# EAGLE design Dash Controller (EAGLE 9.1.1)
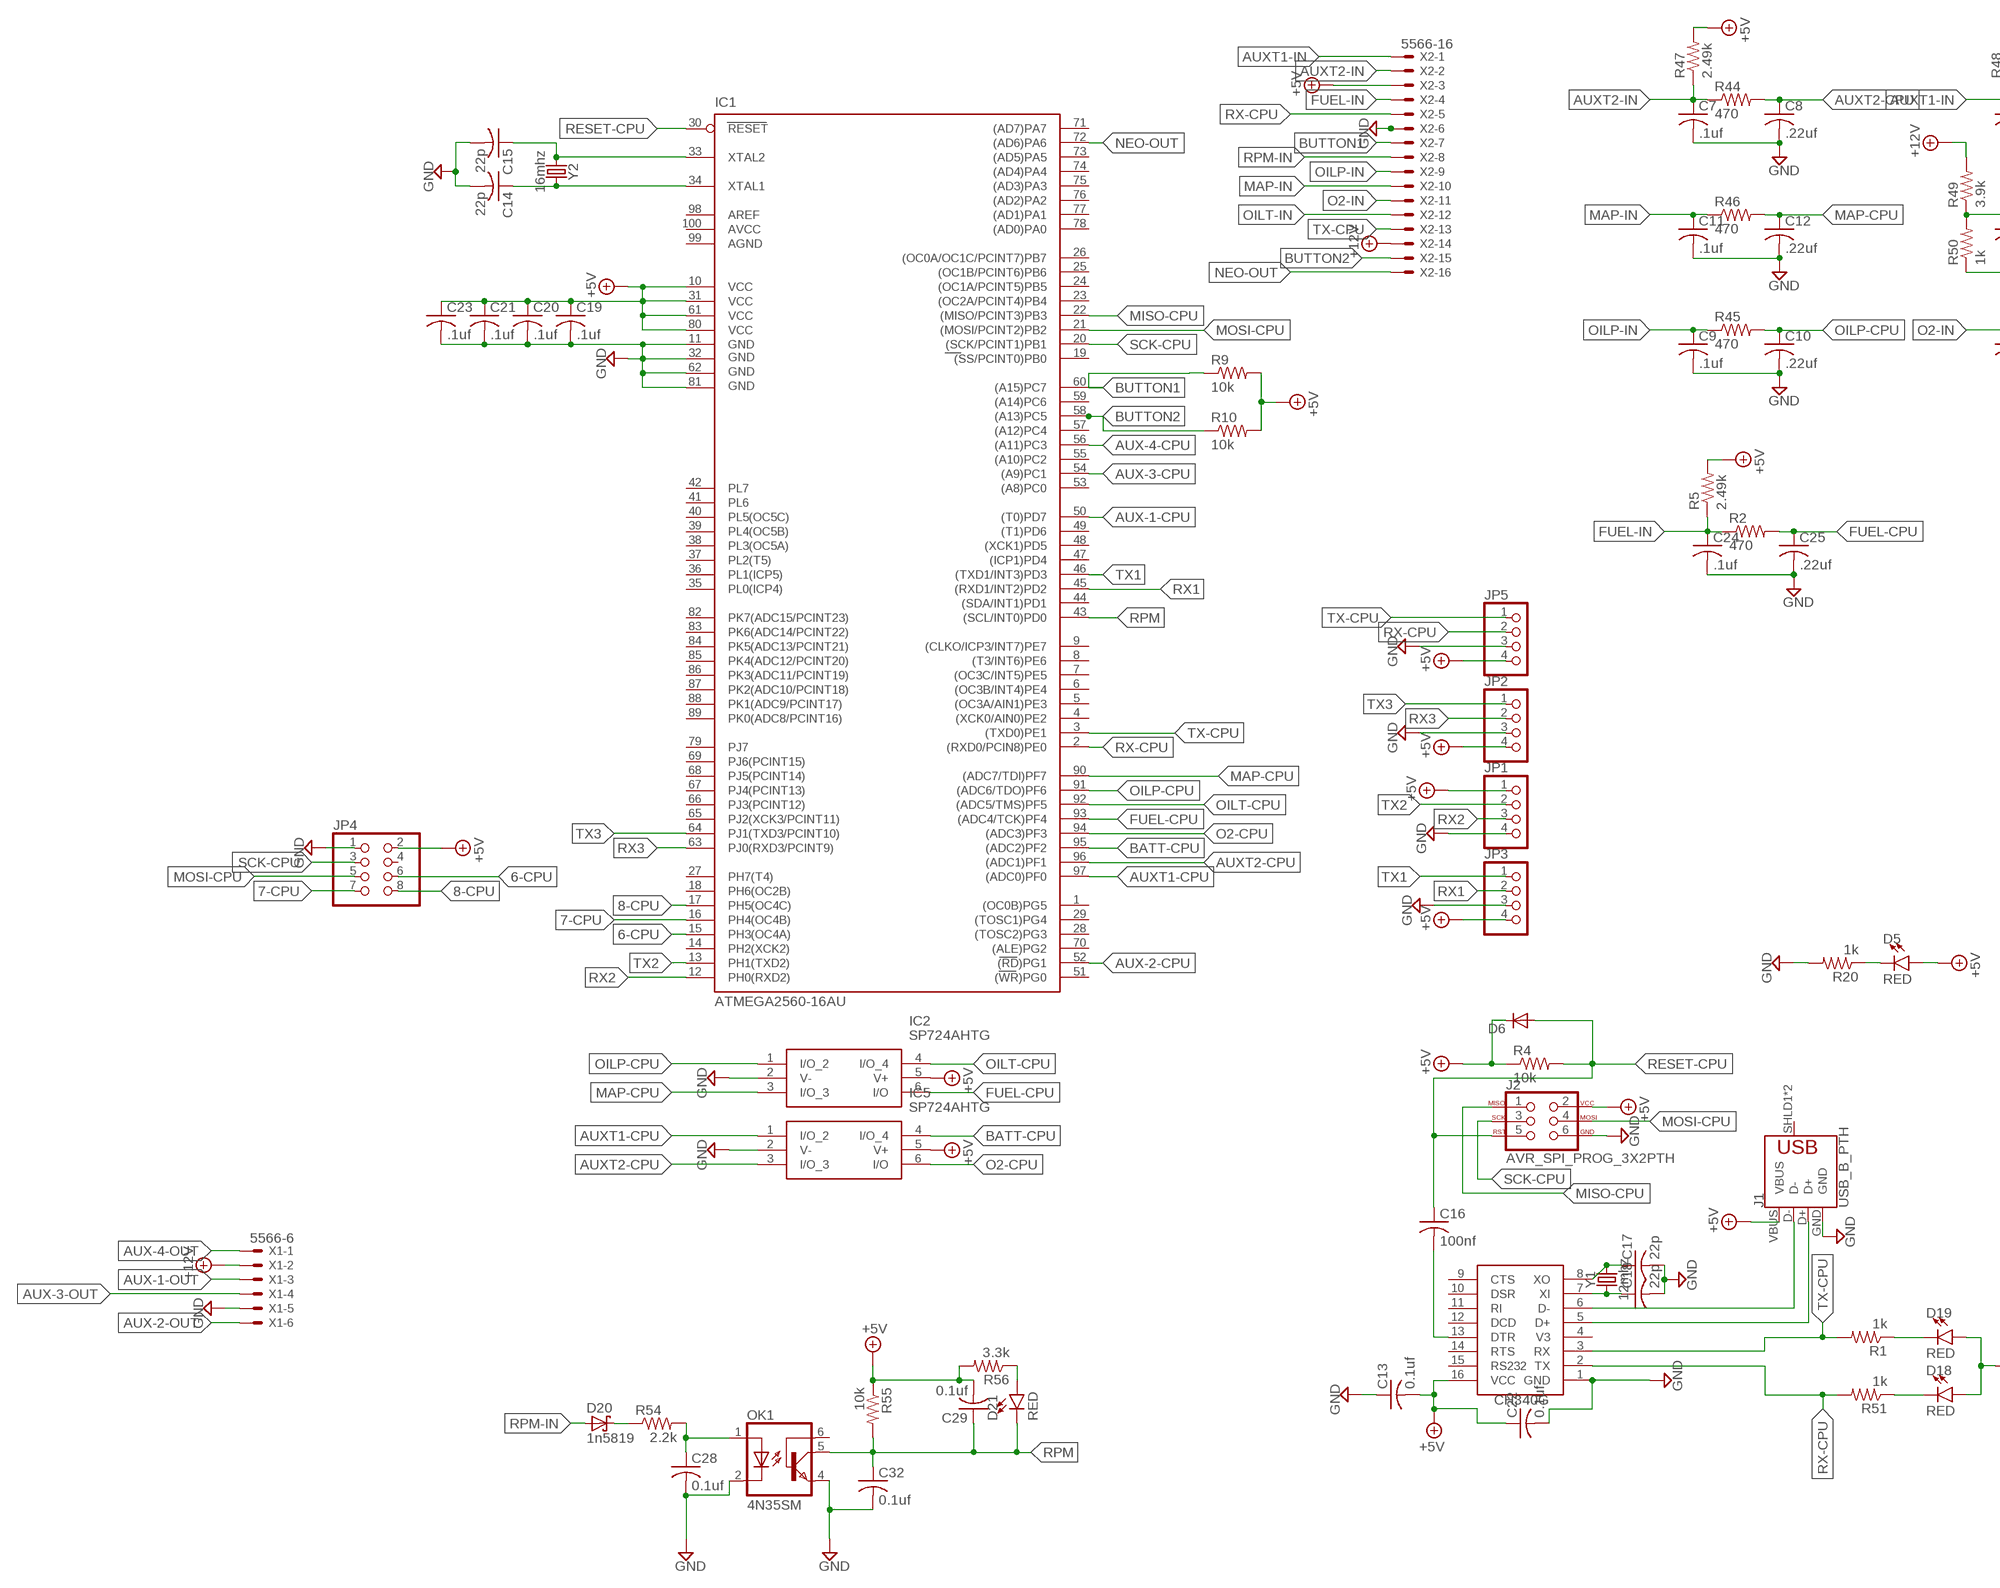
[diagram p0: schematic, sheet 1, part 1 of 2]
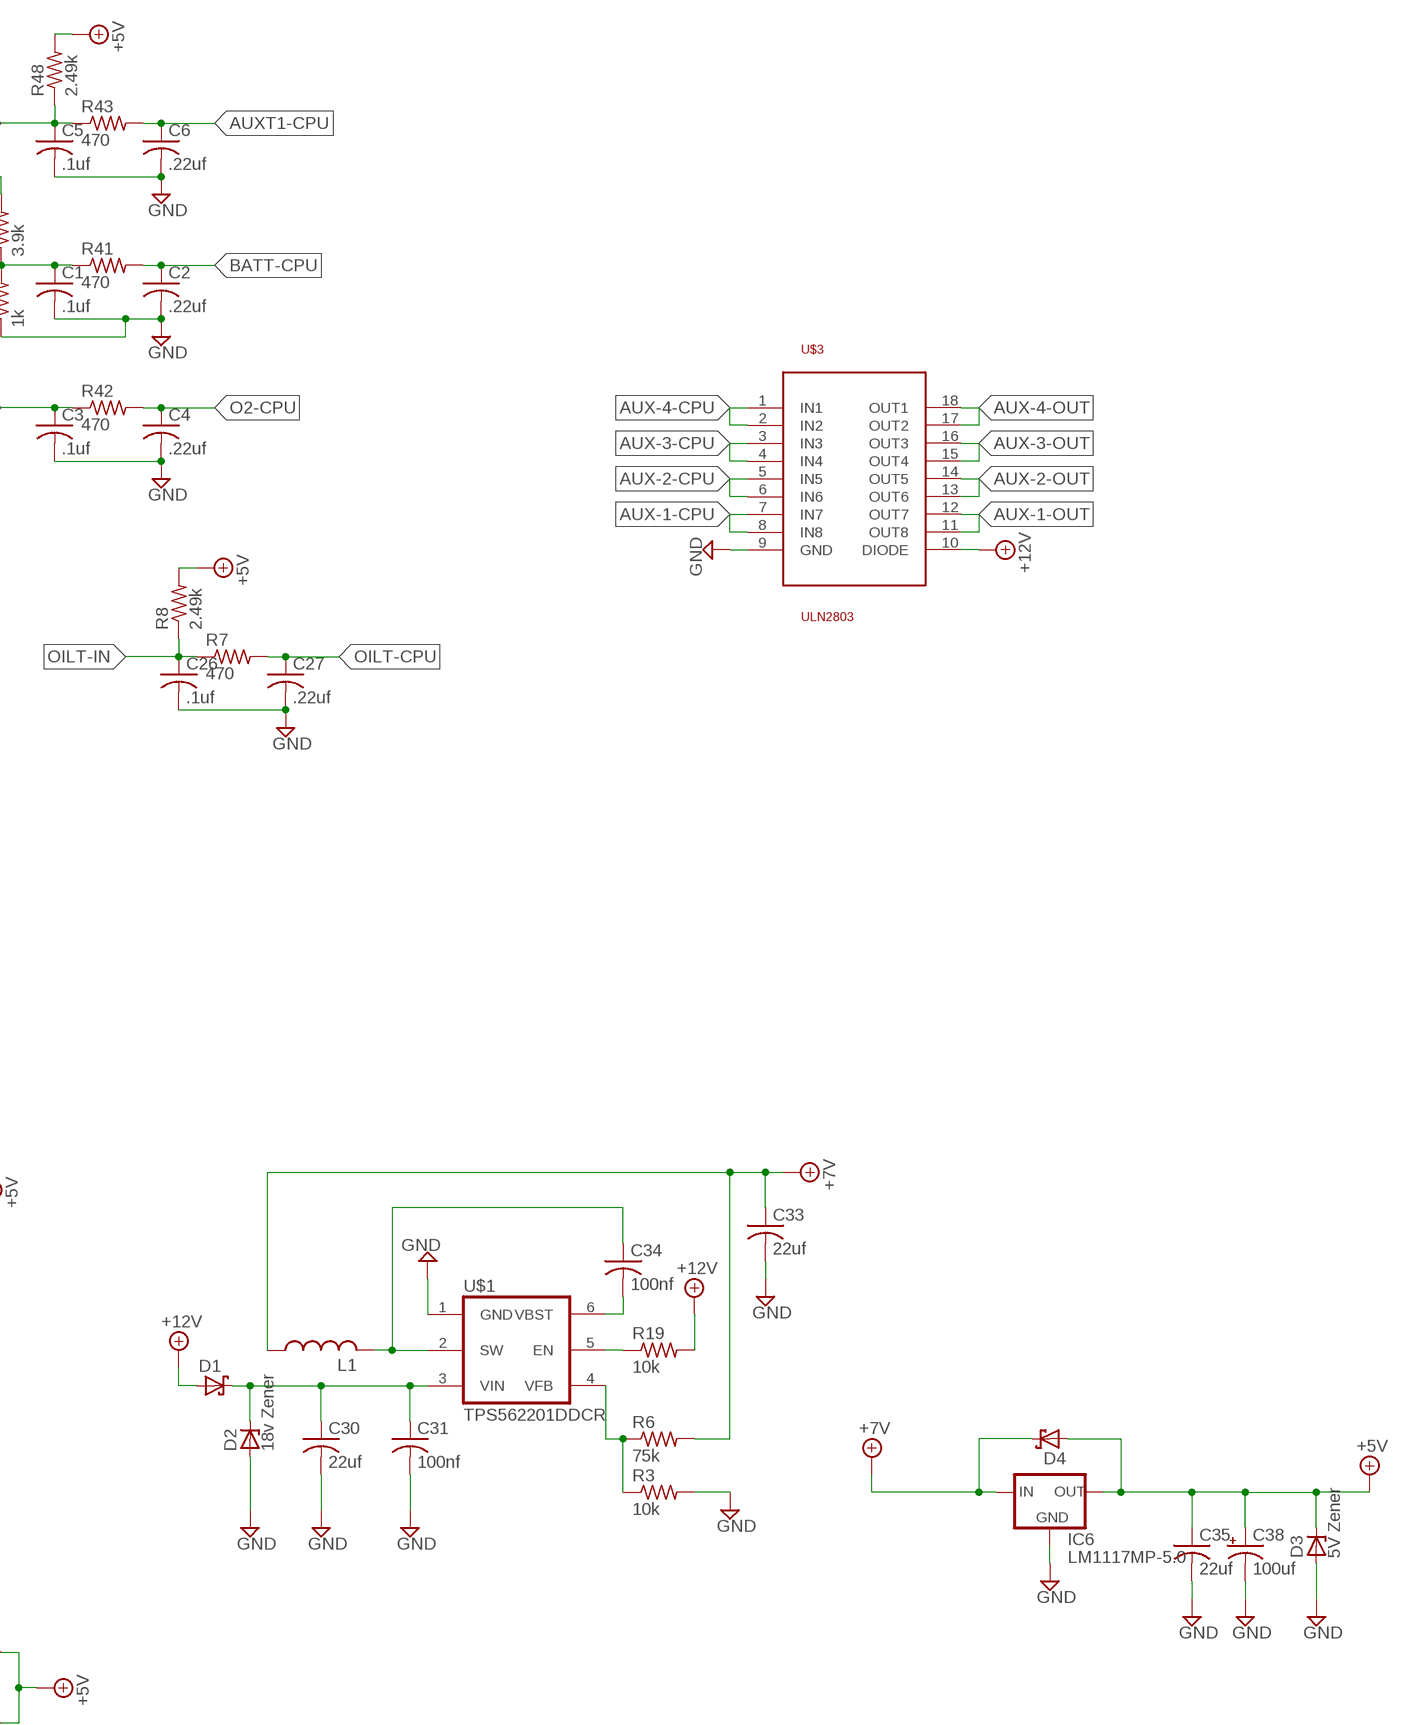
[diagram p1: schematic, sheet 1, part 2 of 2]

## Parts
C1  .1uf  C-USC1206  [C1206]
C2  .22uf  C-USC1206  [C1206]
C3  .1uf  C-USC1206  [C1206]
C4  .22uf  C-USC1206  [C1206]
C5  .1uf  C-USC1206  [C1206]
C6  .22uf  C-USC1206  [C1206]
C7  .1uf  C-USC1206  [C1206]
C8  .22uf  C-USC1206  [C1206]
C9  .1uf  C-USC1206  [C1206]
C10  .22uf  C-USC1206  [C1206]
C11  .1uf  C-USC1206  [C1206]
C12  .22uf  C-USC1206  [C1206]
C13  0.1uf  C-USC1206  [C1206]
C14  22p  C-USC1206  [C1206]
C15  22p  C-USC1206  [C1206]
C16  100nf  C-USC1206  [C1206]
C17  22p  C-USC1206  [C1206]
C18  22p  C-USC1206  [C1206]
C19  .1uf  C-USC1206  [C1206]
C20  .1uf  C-USC1206  [C1206]
C21  .1uf  C-USC1206  [C1206]
C22  0.1uf  C-USC1206  [C1206]
C23  .1uf  C-USC1206  [C1206]
C24  .1uf  C-USC1206  [C1206]
C25  .22uf  C-USC1206  [C1206]
C26  .1uf  C-USC1206  [C1206]
C27  .22uf  C-USC1206  [C1206]
C28  0.1uf  C-USC1206  [C1206]
C29  0.1uf  C-USC1206  [C1206]
C30  22uf  C-USC1206  [C1206]
C31  100nf  C-USC1206  [C1206]
C32  0.1uf  C-USC1206  [C1206]
C33  22uf  C-USC1206  [C1206]
C34  100nf  C-USC1206  [C1206]
C35  22uf  C-USC1206  [C1206]
C38  100uf  CPOL-US153CLV-0605  [153CLV-0605]
D1  SCHOTTKY-DIODESMD  [SMB]
D2  18v Zener  ZENER-DIODESMB  [SMB]
D3  5V Zener  ZENER-DIODESMB  [SMB]
D4  SCHOTTKY-DIODESMD  [SMB]
D5  RED  LED-RED1206  [LED-1206]
D6  DIODE-DO214AA  [DO214AA]
D18  RED  LED-RED1206  [LED-1206]
D19  RED  LED-RED1206  [LED-1206]
D20  1n5819  SCHOTTKY-DIODESMD  [SMB]
D21  RED  LED-RED1206  [LED-1206]
IC1  ATMEGA2560-16AU  [TQFP100]
IC2  SP724AHTG  [SOT95P280X145-6N]
IC5  SP724AHTG  [SOT95P280X145-6N]
IC6  LM1117MP-5.0  [SOT223]
J1  USB_B_PTH  [USB-B-PTH]
J2  AVR_SPI_PROG_3X2PTH  [2X3]
JP1  PINHD-1X4  [1X04]
JP2  PINHD-1X4  [1X04]
JP3  PINHD-1X4  [1X04]
JP4  PINHD-2X4  [2X04]
JP5  PINHD-1X4  [1X04]
L1  L-USPIS2816  [PIS2816]
OK1  4N35SM  [DIL6-SMD]
R1  1k  R-US_R1206  [R1206]
R2  470  R-US_R1206  [R1206]
R3  10k  R-US_R1206  [R1206]
R4  10k  R-US_R1206  [R1206]
R5  2.49k  R-US_R1206  [R1206]
R6  75k  R-US_R1206  [R1206]
R7  470  R-US_R1206  [R1206]
R8  2.49k  R-US_R1206  [R1206]
R9  10k  R-US_R1206  [R1206]
R10  10k  R-US_R1206  [R1206]
R19  10k  R-US_R1206  [R1206]
R20  1k  R-US_R1206  [R1206]
R41  470  R-US_R1206  [R1206]
R42  470  R-US_R1206  [R1206]
R43  470  R-US_R1206  [R1206]
R44  470  R-US_R1206  [R1206]
R45  470  R-US_R1206  [R1206]
R46  470  R-US_R1206  [R1206]
R47  2.49k  R-US_R1206  [R1206]
R48  2.49k  R-US_R1206  [R1206]
R49  3.9k  R-US_R1206  [R1206]
R50  1k  R-US_R1206  [R1206]
R51  1k  R-US_R1206  [R1206]
R54  2.2k  R-US_R1206  [R1206]
R55  10k  R-US_R1206  [R1206]
R56  3.3k  R-US_R1206  [R1206]
U$1  TPS562201DDCR  [SOT23-6L]
U$2  CH340G  [SOIC16]
U$3  ULN2803  [SO18L]
X1  5566-6  [5566-6]
X2  5566-16  [5566-16]
Y1  12mhz  CRYSTALPTH-HC49UV  [HC49U]
Y2  16mhz  CRYSTALPTH-HC49UV  [HC49U]

## Nets
6-CPU: IC1.15(PH3(OC4A)) JP4.6
7-CPU: IC1.16(PH4(OC4B)) JP4.7
8-CPU: IC1.17(PH5(OC4C)) JP4.8
+5V [5V+]: C13.2 C19.1 C20.1 C21.1 C22.1 C23.1 C29.2 C35.1 C38.+ D3.C D4.A D5.A D6.C D18.A D19.A IC1.10(VCC) IC1.31(VCC1) IC1.61(VCC2) IC1.80(VCC3) IC2.5(V+) IC5.5(V+) IC6.2(OUT) IC6.4(OUT) J1.VBUS J2.2 JP1.1 JP2.4 JP3.4 JP4.2 JP5.4 R4.1 R5.2 R8.2 R9.2 R10.2 R47.2 R48.2 R55.1 R56.2 U$2.16(VCC) X2.3
+7V: C33.1 D4.C IC6.3(IN) L1.1 R6.2
+12V [Power]: D1.A R19.2 R49.2 U$3.10(DIODE) X1.2 X2.14
AUX-1-CPU: IC1.50((T0)PD7) U$3.7(IN7) U$3.8(IN8)
AUX-1-OUT [Output]: U$3.11(OUT8) U$3.12(OUT7) X1.3
AUX-2-CPU: IC1.52((RD)PG1) U$3.5(IN5) U$3.6(IN6)
AUX-2-OUT [Output]: U$3.13(OUT6) U$3.14(OUT5) X1.6
AUX-3-CPU: IC1.54((A9)PC1) U$3.3(IN3) U$3.4(IN4)
AUX-3-OUT [Output]: U$3.15(OUT4) U$3.16(OUT3) X1.4
AUX-4-CPU: IC1.56((A11)PC3) U$3.1(IN1) U$3.2(IN2)
AUX-4-OUT [Output]: U$3.17(OUT2) U$3.18(OUT1) X1.1
AUXT1-CPU: C6.1 IC1.97((ADC0)PF0) IC5.1(I/O_2) R43.2
AUXT1-IN: C5.1 R43.1 R48.1 X2.1
AUXT2-CPU: C8.1 IC1.96((ADC1)PF1) IC5.3(I/O_3) R44.2
AUXT2-IN: C7.1 R44.1 R47.1 X2.2
BATT-CPU: C2.1 IC1.95((ADC2)PF2) IC5.4(I/O_4) R41.2
BUTTON1: IC1.60((A15)PC7) R9.1 X2.7
BUTTON2: IC1.58((A13)PC5) R10.1 X2.15
FUEL-CPU: C25.1 IC1.93((ADC4/TCK)PF4) IC2.6(I/O) R2.2
FUEL-IN: C24.1 R2.1 R5.1 X2.4
GND [GND]: C1.2 C2.2 C3.2 C4.2 C5.2 C6.2 C7.2 C8.2 C9.2 C10.2 C11.2 C12.2 C13.1 C14.2 C15.2 C17.2 C18.2 C19.2 C20.2 C21.2 C22.2 C23.2 C24.2 C25.2 C26.2 C27.2 C28.2 C30.2 C31.2 C32.2 C33.2 C35.2 C38.- D2.A D3.A IC1.11(GND) IC1.32(GND1) IC1.62(GND2) IC1.81(GND3) IC2.2(V-) IC5.2(V-) IC6.1(GND) J1.GND J2.6 JP1.4 JP2.3 JP3.3 JP4.1 JP5.3 OK1.2(C) OK1.4(EMI) R3.2 R20.2 R50.1 U$1.1(GND) U$2.1(GND) U$3.9(GND) X1.5 X2.6
MAP-CPU: C12.1 IC1.90((ADC7/TDI)PF7) IC2.3(I/O_3) R46.2
MAP-IN: C11.1 R46.1 X2.10
MISO-CPU: IC1.22((MISO/PCINT3)PB3) J2.1
MOSI-CPU: IC1.21((MOSI/PCINT2)PB2) J2.4 JP4.5
N$2: J1.D+ U$2.5(D+)
N$3: J1.D- U$2.6(D-)
N$5: C14.1 IC1.34(XTAL1) Y2.2
N$6: C15.1 IC1.33(XTAL2) Y2.1
N$8: D5.C R20.1
N$9: C16.2 U$2.13(DTR)
N$15: C18.1 U$2.7(XI) Y1.1
N$16: C17.1 U$2.8(XO) Y1.2
N$22: C30.1 C31.1 D1.C D2.C U$1.3(VIN)
N$23: C34.2 U$1.6(VBST)
N$24: R19.1 U$1.5(EN)
N$42: C1.1 R41.1 R49.1 R50.2
N$100: D19.C R1.1
N$101: D18.C R51.1
N$107: D20.C R54.1
N$108: C28.1 OK1.1(A) R54.2
N$110: D21.A R56.1
NEO-OUT [IGN]: IC1.72((AD6)PA6) X2.16
O2-CPU: C4.1 IC1.94((ADC3)PF3) IC5.6(I/O) R42.2
O2-IN: C3.1 R42.1 X2.11
OILP-CPU: C10.1 IC1.91((ADC6/TDO)PF6) IC2.1(I/O_2) R45.2
OILP-IN: C9.1 R45.1 X2.9
OILT-CPU: C27.1 IC1.92((ADC5/TMS)PF5) IC2.4(I/O_4) R7.2
OILT-IN: C26.1 R7.1 R8.1 X2.12
RESET-CPU: C16.1 D6.A IC1.30(RESET) J2.5 R4.2
RPM: C29.1 C32.1 D21.C IC1.43((SCL/INT0)PD0) OK1.5(COL) R55.2
RPM-IN: D20.A X2.8
RX1: IC1.45((RXD1/INT2)PD2) JP3.2
RX2: IC1.12(PH0(RXD2)) JP1.3
RX3: IC1.63(PJ0(RXD3/PCINT9)) JP2.2
RX-CPU: IC1.2((RXD0/PCIN8)PE0) JP5.2 R51.2 U$2.2(TX) X2.5
SCK-CPU: IC1.20((SCK/PCINT1)PB1) J2.3 JP4.3
SW: C34.1 L1.2 U$1.2(SW)
TX1: IC1.46((TXD1/INT3)PD3) JP3.1
TX2: IC1.13(PH1(TXD2)) JP1.2
TX3: IC1.64(PJ1(TXD3/PCINT10)) JP2.1
TX-CPU: IC1.3((TXD0)PE1) JP5.1 R1.2 U$2.3(RX) X2.13
VFB: R3.1 R6.1 U$1.4(VFB)
Unconnected: IC1.1((OC0B)PG5) IC1.4((XCK0/AIN0)PE2) IC1.5((OC3A/AIN1)PE3) IC1.6((OC3B/INT4)PE4) IC1.7((OC3C/INT5)PE5) IC1.8((T3/INT6)PE6) IC1.9((CLKO/ICP3/INT7)PE7) IC1.14(PH2(XCK2)) IC1.18(PH6(OC2B)) IC1.19((SS/PCINT0)PB0) IC1.23((OC2A/PCINT4)PB4) IC1.24((OC1A/PCINT5)PB5) IC1.25((OC1B/PCINT6)PB6) IC1.26((OC0A/OC1C/PCINT7)PB7) IC1.27(PH7(T4)) IC1.28((TOSC2)PG3) IC1.29((TOSC1)PG4) IC1.35(PL0(ICP4)) IC1.36(PL1(ICP5)) IC1.37(PL2(T5)) IC1.38(PL3(OC5A)) IC1.39(PL4(OC5B)) IC1.40(PL5(OC5C)) IC1.41(PL6) IC1.42(PL7) IC1.44((SDA/INT1)PD1) IC1.47((ICP1)PD4) IC1.48((XCK1)PD5) IC1.49((T1)PD6) IC1.51((WR)PG0) IC1.53((A8)PC0) IC1.55((A10)PC2) IC1.57((A12)PC4) IC1.59((A14)PC6) IC1.65(PJ2(XCK3/PCINT11)) IC1.66(PJ3(PCINT12)) IC1.67(PJ4(PCINT13)) IC1.68(PJ5(PCINT14)) IC1.69(PJ6(PCINT15)) IC1.70((ALE)PG2) IC1.71((AD7)PA7) IC1.73((AD5)PA5) IC1.74((AD4)PA4) IC1.75((AD3)PA3) IC1.76((AD2)PA2) IC1.77((AD1)PA1) IC1.78((AD0)PA0) IC1.79(PJ7) IC1.82(PK7(ADC15/PCINT23)) IC1.83(PK6(ADC14/PCINT22)) IC1.84(PK5(ADC13/PCINT21)) IC1.85(PK4(ADC12/PCINT20)) IC1.86(PK3(ADC11/PCINT19)) IC1.87(PK2(ADC10/PCINT18)) IC1.88(PK1(ADC9/PCINT17)) IC1.89(PK0(ADC8/PCINT16)) IC1.98(AREF) J1.SHLD1(SHIELD) J1.SHLD2(SHIELD) JP4.4 OK1.6(BAS) U$2.4(V3) U$2.9(CTS) U$2.10(DSR) U$2.11(RI) U$2.12(DCD) U$2.14(RTS) U$2.15(RS232)

## Power pins joined to a net without a drawn wire
AGND: IC1.99(AGND)
AVCC: IC1.100(AVCC)

## Library data of the parts
C1-C32 C34 = resistor:C-US: CAPACITOR, American symbol
C33 C35 = resistor:C-US: CAPACITOR, American symbol; SPICEPREFIX: C
C38 = resistor:CPOL-US: POLARIZED CAPACITOR, American symbol
D1 D4 D20 = diode:SCHOTTKY-DIODE: Schottky Diode
D2 D3 = diode:ZENER-DIODE: Z-Diode
D5 D18 D19 D21 = SparkFun-LED:LED-RED: Red SMD LED Used in manufacturing of most products at SparkFun Packages: 0603 - SMD 0603 package [Product Link] <http://docs.avagotech.com/docs/AV02-0551EN> 0603 SMART - SMD 0603 SMART package ( more efficient and expensive)[Product Link] <http://www.osram-os.com/Graphics/XPic2/00077099_0.pdf> 1206 - SMD1206 package [Product Link] <https://www.sparkfun.com/datasheets/DevTools/LilyPad/Q150OVS4.pdff> SparkFun Products: Pro Mini 328 -5V <https://www.sparkfun.com/products/821> RedBoard <https://www.sparkfun.com/products/12757> IOIO-OTG <https://www.sparkfun.com/products/13613>; PROD_ID: DIO-09912
D6 = diode:DIODE-: DIODE
IC1 = atmel-2005:ATMEGA*: MICROCONTROLLER 64/128/256 Kbytes FLASH 4 Kbytes EEPROM 8 Kbytes SRAM 86 General Purpose I/O pins 12-channels16-bit PWM 4 x Serial USARTs 16-channels 10-bit A/D
IC2 IC5 = SP724AHTG:SP724AHTG: Littelfuse SP724AHTG Quad Uni-Directional Over-voltage Protector, 6-Pin SOT-23 Source: Datasheet; ARROW_PART_NUMBER: SP724AHTG; ARROW_PRICE/STOCK: https://www.arrow.com/en/products/sp724ahtg/littelfuse; DESCRIPTION: Littelfuse SP724AHTG Quad Uni-Directional Over-voltage Protector, 6-Pin SOT-23; HEIGHT: mm; MANUFACTURER_NAME: LITTELFUSE; MANUFACTURER_PART_NUMBER: SP724AHTG; RS_PART_NUMBER: 7931982; RS_PRICE/STOCK: http://uk.rs-online.com/web/p/products/7931982
IC6 = lm1117_10:LM1117?-*: 800mA Low-Dropout Linear Regulator Source: http://www.ti.com/lit/ds/symlink/lm1117-n.pdf; MF: Texas Instruments; MPN: LM1117MP-5.0; OC_FARNELL: 9778209; OC_NEWARK: 28X3417
J1 = SparkFun-Connectors:USB_B: USB Type B Connector SparkFun Products: SparkFun Stepoko <https://www.sparkfun.com/products/13899> PTH; PROD_ID: CONN-08278; SF_ID: PRT-00139
J2 = SparkFun-Connectors:AVR_SPI_PROG_3X2: AVR ISP 6 Pin This is the reduced ISP connector for AVR programming. Common on Arduino. This footprint will take up less PCB space and can be used with a 10-pin to 6-pin adapter such as SKU: BOB-08508 **Special note about "TEST_POINT" package. The stop mask is on the top side, so if you want your programming test points to be on the bottom of your board, make sure to place this package on the bottom side of the board. This also ensure that the orientation to program from the bottom side will be correct. SparkFun Products: SparkFun ISP Pogo Adapter <https://www.sparkfun.com/products/11591> - NS Tiny AVR Programmer <https://www.sparkfun.com/products/11801> -PTH
JP1-JP3 JP5 = pinhead:PINHD-1X4: PIN HEADER
JP4 = pinhead:PINHD-2X4: PIN HEADER
L1 = rcl:L-US: INDUCTOR, American symbol
OK1 = optocoupler:4N*?M: General Purpose 6-Pin Phototransistor Optocouplers Source: http://www.fairchildsemi.com/ds/4N/4N35-M.pdf; MF: FAIRCHILD SEMICONDUCTOR; MPN: 4N35S-M; OC_FARNELL: 1021179; OC_NEWARK: 67K2285
R1-R10 R19 R20 R41-R51 R54-R56 = resistor:R-US_: RESISTOR, American symbol
U$1 = TPS562201DDCR:TPS562201DDCR
U$2 = ch340g:CH340G
U$3 = ULN2803:ULN2803; AVAILABILITY: Unavailable; MF: Toshiba; MP: ULN2803; PACKAGE: SOIC-18 Toshiba; PRICE: None
X1 = Molex_connectors:5566-6: Mini FIT connector 6 pol Source: http://www.molex.com; MF: MOLEX; MPN: 95566-61002; OC_FARNELL: unknown; OC_NEWARK: 22K8620
X2 = Molex_connectors:5566-16: Mini FIT connector 16 pol Source: http://www.molex.com; MF: MOLEX; OC_FARNELL: unknown; OC_NEWARK: unknown
Y1 Y2 = SparkFun-Clocks:CRYSTAL: Crystals (Generic) These are passive quartz crystals, which can be used as a clock source for a microcontroller. Crystal's are two-terminal devices. They require external "load" capacitors to generate an oscillating signal.

## Net classes
0 default: width 0.254 mm, clearance 0.152 mm
1 Power: width 0.762 mm, clearance 0.152 mm
2 Output: width 0.61 mm, clearance 0.152 mm
3 IGN: width 0.305 mm, clearance 0.152 mm
4 5V+: width 0.305 mm, clearance 0.152 mm
5 Relay: width 0.406 mm, clearance 0.152 mm
6 GND: width 0.305 mm, clearance 0.152 mm

## Board
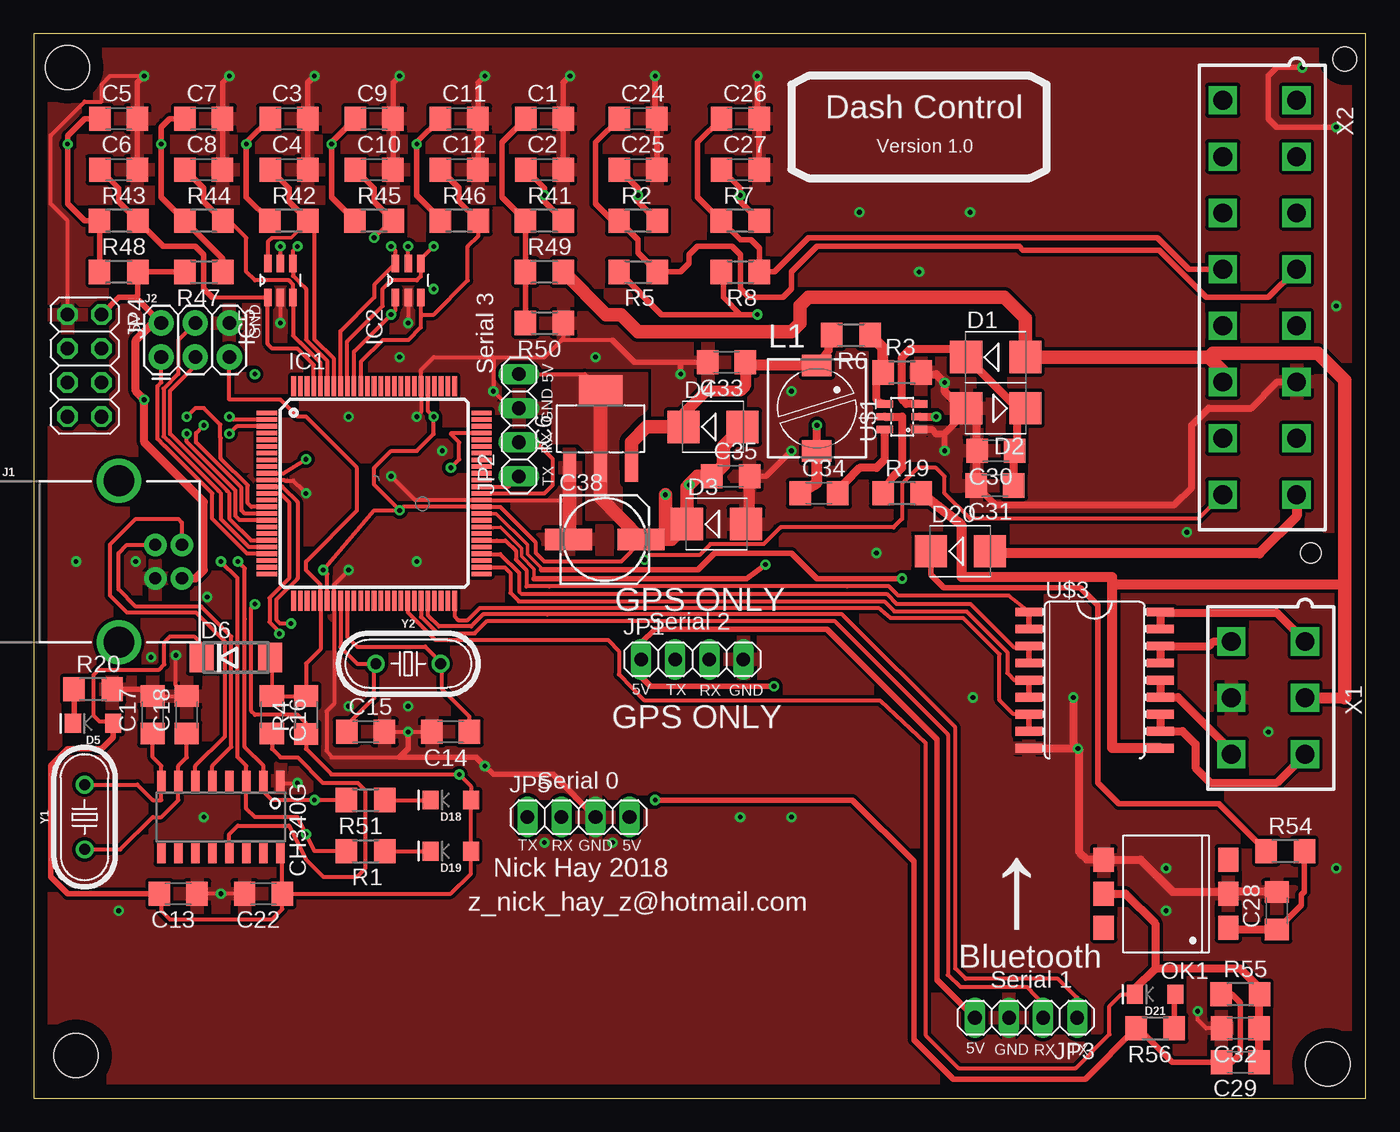
[diagram p2: board, top side]
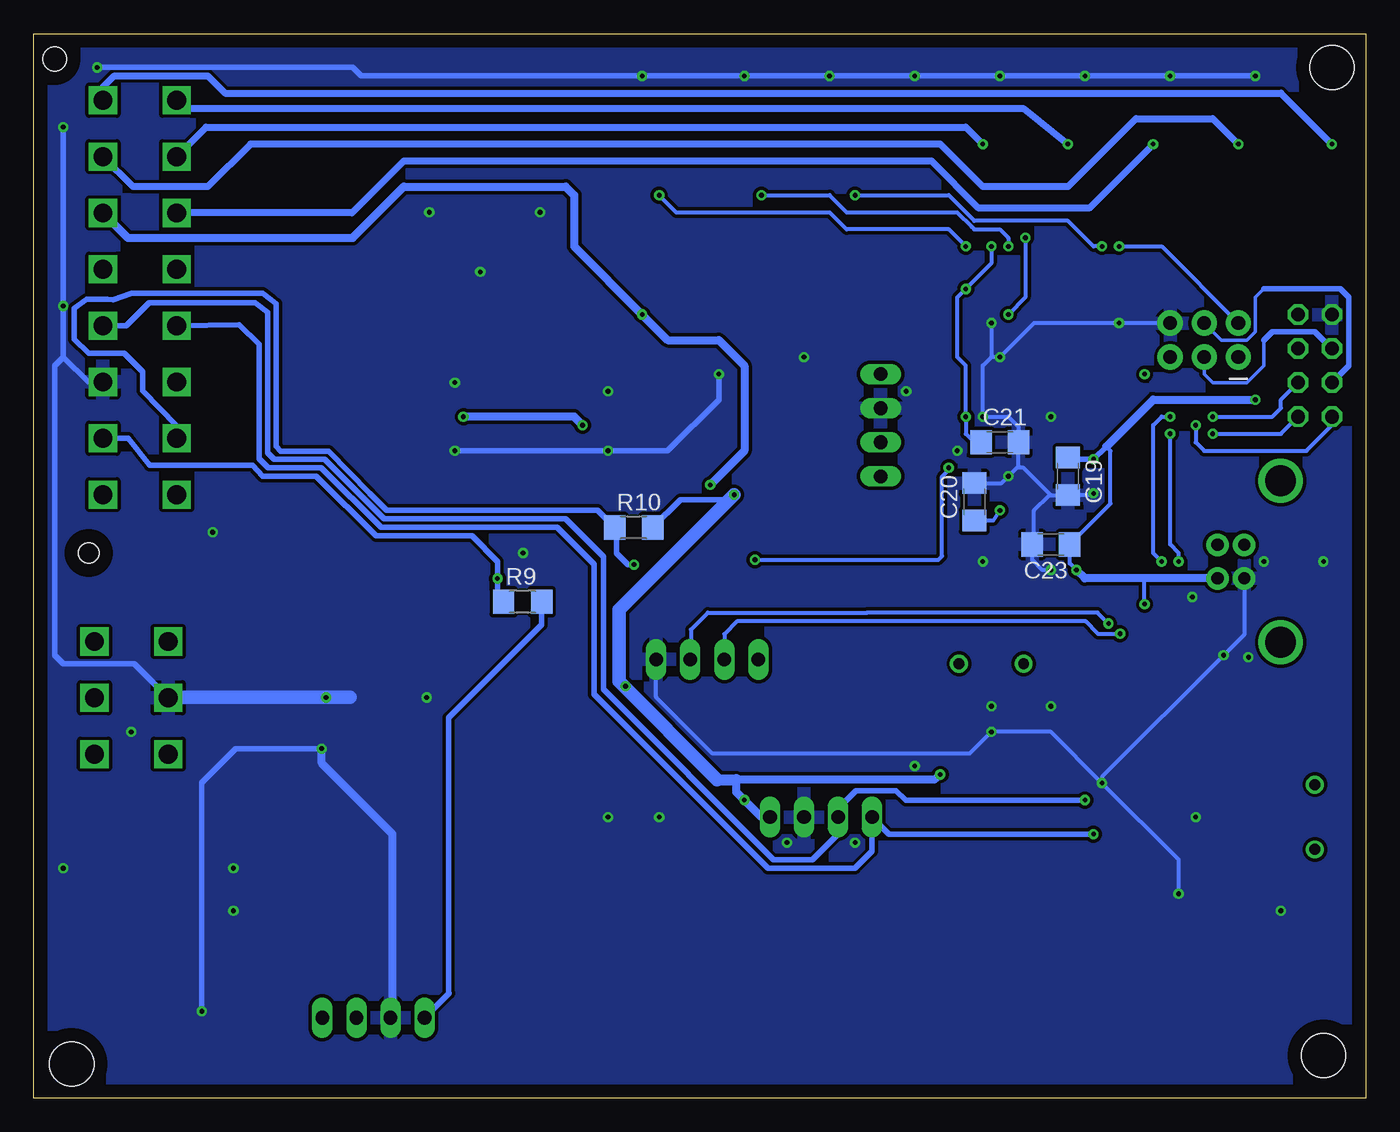
[diagram p3: board, bottom side, seen from below]

Size 99.36 x 79.36 mm. Coordinates in mm from the lower left corner, seen from the top.
Outline: 0,0 99.36,0 99.36,79.36 0,79.36 0,0
Copper layers (1*16): Top 0.035mm / dielectric 1.5mm / Bottom 0.035mm
Design rules "default": minimum track width 6mil, minimum drill 0.35mm, track to track 6mil, track to pad 6mil, pad to pad 6mil, via to via 6mil, smd to smd 6mil, copper to edge 40mil, drill to drill 6mil, minimum pad ring 10mil, minimum via ring 8mil, stop-mask expansion 4mil, vias tented up to drill 0mil, thermal gap 10mil
Holes 3.3 mm at 2.54,76.83 96.52,2.54 3.17,3.17
Holes 1.78 mm at 97.79,77.47
Holes 1.52 mm at 95.25,40.64

### Footprints (pad centres in the part's own frame; a part is rotated, then mirrored left to right if it is on the bottom)
C1206 = smd 1.6 x 1.8: 1 -1.4,0; 2 1.4,0
153CLV-0605 = smd 3.5 x 1.6: + 2.7,0; - -2.7,0
SMB = smd 2.4 x 2.4: A 2.2,0; C -2.2,0
LED-1206 = smd 1.2 x 1.4: A -1.5,0; C 1.5,0
DO214AA = smd 1.8 x 2.2: A 2.55,0; C -2.55,0
TQFP100 = smd 1.5 x 0.35: 1 -8,6; 2 -8,5.5; 3 -8,5; 4 -8,4.5; 5 -8,4; 6 -8,3.5; 7 -8,3; 8 -8,2.5; 9 -8,2; 10 -8,1.5; 11 -8,1; 12 -8,0.5; 13 -8,0; 14 -8,-0.5; 15 -8,-1; 16 -8,-1.5; 17 -8,-2; 18 -8,-2.5; 19 -8,-3; 20 -8,-3.5; 21 -8,-4; 22 -8,-4.5; 23 -8,-5; 24 -8,-5.5; 25 -8,-6; 51 8,-6; 52 8,-5.5; 53 8,-5; 54 8,-4.5; 55 8,-4; 56 8,-3.5; 57 8,-3; 58 8,-2.5; 59 8,-2; 60 8,-1.5; 61 8,-1; 62 8,-0.5; 63 8,0; 64 8,0.5; 65 8,1; 66 8,1.5; 67 8,2; 68 8,2.5; 69 8,3; 70 8,3.5; 71 8,4; 72 8,4.5; 73 8,5; 74 8,5.5; 75 8,6 | smd 0.35 x 1.5: 26 -6,-8; 27 -5.5,-8; 28 -5,-8; 29 -4.5,-8; 30 -4,-8; 31 -3.5,-8; 32 -3,-8; 33 -2.5,-8; 34 -2,-8; 35 -1.5,-8; 36 -1,-8; 37 -0.5,-8; 38 0,-8; 39 0.5,-8; 40 1,-8; 41 1.5,-8; 42 2,-8; 43 2.5,-8; 44 3,-8; 45 3.5,-8; 46 4,-8; 47 4.5,-8; 48 5,-8; 49 5.5,-8; 50 6,-8; 76 6,8; 77 5.5,8; 78 5,8; 79 4.5,8; 80 4,8; 81 3.5,8; 82 3,8; 83 2.5,8; 84 2,8; 85 1.5,8; 86 1,8; 87 0.5,8; 88 0,8; 89 -0.5,8; 90 -1,8; 91 -1.5,8; 92 -2,8; 93 -2.5,8; 94 -3,8; 95 -3.5,8; 96 -4,8; 97 -4.5,8; 98 -5,8; 99 -5.5,8; 100 -6,8
SOT95P280X145-6N = smd 1.321 x 0.559: 1 -1.27,0.94; 2 -1.27,0; 3 -1.27,-0.94; 4 1.27,-0.94; 5 1.27,0; 6 1.27,0.94
SOT223 = smd 0.95 x 2.15: 1 -2.3,-2.9; 2 0,-2.9; 3 2.3,-2.9 | smd 3.25 x 2.15: 4 0,2.9
USB-B-PTH = drill 0.914 pad 1.676: D+ 4,1.25; D- 5.981,1.25; GND 4,-1.25; VBUS 5.981,-1.25 | drill 2.286: SHLD1 1.282,-6.02; SHLD2 1.282,6.02
2X3 = drill 1.016 pad 1.88: 1 0,0; 2 0,2.54; 3 2.54,0; 4 2.54,2.54; 5 5.08,0; 6 5.08,2.54
1X04 = drill 1.016 long: 1 -3.81,0; 2 -1.27,0; 3 1.27,0; 4 3.81,0
2X04 = drill 1.016 octagon: 1 -3.81,-1.27; 2 -3.81,1.27; 3 -1.27,-1.27; 4 -1.27,1.27; 5 1.27,-1.27; 6 1.27,1.27; 7 3.81,-1.27; 8 3.81,1.27
PIS2816 = smd 2.2 x 1.6: 1 0,3.2; 2 0,-3.2
DIL6-SMD = smd 1.78 x 1.52: 1 -2.54,-4.645; 2 0,-4.645; 3 2.54,-4.645; 4 2.54,4.645; 5 0,4.645; 6 -2.54,4.645
R1206 = smd 1.6 x 1.803: 1 -1.422,0; 2 1.422,0
SOT23-6L = smd 0.55 x 1.2: 1 -0.95,-1.3; 2 0,-1.3; 3 0.95,-1.3; 4 0.95,1.3; 5 0,1.3; 6 -0.95,1.3
SOIC16 = smd 0.635 x 1.524: 1 -4.445,-2.695; 2 -3.175,-2.695; 3 -1.905,-2.695; 4 -0.635,-2.695; 5 0.635,-2.695; 6 1.905,-2.695; 7 3.175,-2.695; 8 4.445,-2.695; 9 4.445,2.695; 10 3.175,2.695; 11 1.905,2.695; 12 0.635,2.695; 13 -0.635,2.695; 14 -1.905,2.695; 15 -3.175,2.695; 16 -4.445,2.695
SO18L = smd 0.66 x 2.032: 1 -5.08,-4.902; 2 -3.81,-4.902; 3 -2.54,-4.902; 4 -1.27,-4.902; 5 0,-4.902; 6 1.27,-4.902; 7 2.54,-4.902; 8 3.81,-4.902; 9 5.08,-4.902; 10 5.08,4.902; 11 3.81,4.902; 12 2.54,4.902; 13 1.27,4.902; 14 0,4.902; 15 -1.27,4.902; 16 -2.54,4.902; 17 -3.81,4.902; 18 -5.08,4.902
5566-6 = drill 1.4 square: 1 4.2,-2.75; 2 0,-2.75; 3 -4.2,-2.75; 4 4.2,2.75; 5 0,2.75; 6 -4.2,2.75
5566-16 = drill 1.4 square: 1 14.7,-2.75; 2 10.5,-2.75; 3 6.3,-2.75; 4 2.1,-2.75; 5 -2.1,-2.75; 6 -6.3,-2.75; 7 -10.5,-2.75; 8 -14.7,-2.75; 9 14.7,2.75; 10 10.5,2.75; 11 6.3,2.75; 12 2.1,2.75; 13 -2.1,2.75; 14 -6.3,2.75; 15 -10.5,2.75; 16 -14.7,2.75
HC49U = drill 0.813: 1 -2.413,0; 2 2.413,0

### Placement (x,y rotation side)
C1  38.1,73.03 0 top
C2  38.1,69.22 0 top
C3  19.05,73.03 0 top
C4  19.05,69.22 0 top
C5  6.35,73.03 0 top
C6  6.35,69.22 0 top
C7  12.7,73.03 0 top
C8  12.7,69.22 0 top
C9  25.4,73.03 0 top
C10  25.4,69.22 0 top
C11  31.75,73.03 0 top
C12  31.75,69.22 0 top
C13  10.79,15.24 180 top
C14  31.11,27.3 180 top
C15  24.77,27.3 0 top
C16  17.78,28.57 270 top
C17  8.89,28.57 90 top
C18  11.43,28.57 90 top
C19  22.23,46.35 270 bottom
C20  29.21,44.45 90 bottom
C21  27.3,48.9 0 bottom
C22  17.14,15.24 180 top
C23  23.5,41.27 180 bottom
C24  45.09,73.03 0 top
C25  45.09,69.22 0 top
C26  52.7,73.03 0 top
C27  52.7,69.22 0 top
C28  92.71,13.97 90 top
C29  89.99,2.67 180 top
C30  71.75,48.26 180 top
C31  71.7,45.67 180 top
C32  89.99,5.21 180 top
C33  51.69,54.86 180 top
C34  58.57,45.09 0 top
C35  51.99,46.35 0 top
C38  42.6,41.66 0 top
D1  71.75,55.24 0 top
D2  71.75,51.44 180 top
D3  50.93,42.8 0 top
D4  50.67,50.04 0 top
D5  4.45,27.94 180 top
D6  15.09,32.84 0 top
D18  31.11,22.23 180 top
D19  31.11,18.41 180 top
D20  69.11,40.77 0 top
D21  83.64,7.75 180 top
IC1  25.4,45.09 0 top
IC2  27.94,60.96 90 top
IC5  18.41,60.96 90 top
IC6  42.29,49.91 0 top
J1  5.08,40.01 0 top
J2  9.53,55.24 0 top
JP1  49.12,32.72 0 top
JP2  36.2,50.16 90 top
JP3  74.02,5.99 180 top
JP4  3.81,54.61 270 top
JP5  40.64,20.95 0 top
L1  58.42,51.44 0 top
OK1  84.45,15.24 90 top
R1  24.77,18.41 180 top
R2  45.09,65.41 0 top
R3  64.77,54.1 0 top
R4  20.32,28.57 90 top
R5  45.09,61.59 180 top
R6  60.96,56.9 180 top
R7  52.7,65.41 0 top
R8  52.7,61.59 180 top
R9  62.89,37.01 0 bottom
R10  54.61,42.55 0 bottom
R19  64.77,45.09 0 top
R20  4.45,30.48 0 top
R41  38.1,65.41 0 top
R42  19.05,65.41 0 top
R43  6.35,65.41 0 top
R44  12.7,65.41 0 top
R45  25.4,65.41 0 top
R46  31.75,65.41 0 top
R47  12.7,61.59 180 top
R48  6.35,61.59 0 top
R49  38.1,61.59 0 top
R50  38.1,57.78 180 top
R51  24.77,22.23 180 top
R54  93.34,18.41 0 top
R55  89.99,7.75 0 top
R56  83.64,5.21 180 top
U$1  64.77,50.8 90 top
U$2  13.97,20.95 180 top
U$3  79.12,31.17 270 top
X1  92.08,29.84 90 top
X2  91.44,59.69 90 top
Y1  3.81,20.95 90 top
Y2  27.94,32.38 0 top

### Tracks (layer width: path | path; a pad name or v marks a point on that pad's centre or on a via)
6-CPU  (via drill 0.35)
  Top 0.305: IC1.15 16.24,44.09 15.98,44.35 15.98,45.68 13.97,47.68 13.97,49.2 13.92,49.25 13.92,50.21 12.7,51.44 12.06,51.44 v11.43,50.8
  Bottom 0.305: v11.43,50.8 6.99,50.8 6.35,51.44 6.35,52.07 JP4.6
7-CPU  (via drill 0.35)
  Top 0.305: IC1.16 15.75,43.59 15.52,43.81 15.52,45.49 12.11,48.89 12.11,49.58 v12.7,50.16
  Bottom 0.305: v12.7,50.16 12.7,48.9 12.06,48.26 4.45,48.26 2.54,50.16 JP4.7
8-CPU  (via drill 0.35)
  Top 0.305: IC1.17 15.37,43.09 15.06,43.39 15.06,45.3 11.43,48.93 v11.43,49.53
  Bottom 0.305: v11.43,49.53 6.35,49.53 JP4.8
+5V  (via drill 0.35)
  Top 0.305: C13.2 9.53,15.11 9.53,13.97 10.16,13.34 17.78,13.34 18.55,14.1 C22.1 | C22.1 18.55,18.13 U$2.16 | C22.1 31.11,15.24 32.62,16.74 D19.A D18.A 32.62,23.27 v31.75,24.13 22.23,24.13 20.32,26.04 R4.1 20.32,27.94 19.68,28.57 16.51,28.57 16.23,28.85 16.23,36.55 v16.51,36.83 | IC1.10 18.64,46.59 v20.32,47.62 | v27.3,43.81 27.57,44.09 IC1.61 34.78,44.09 37.47,41.4 37.47,40.64 38.1,40.01 43.81,40.01 45.31,41.5 C38.+ | IC1.80 29.4,51.24 v29.84,50.8 29.84,49.53 28.57,48.26 26.67,48.26 25.4,46.99 25.4,45.72 v27.3,43.81 | IC1.31 21.9,39.06 v21.59,39.37 25.4,43.81 v27.3,43.81 | JP2.4 41.13,53.98 IC6.4 | IC2.5 v27.94,63.5 | IC5.5 v18.41,63.5 | D5.A 5.82,28.07 4.93,28.07 4.47,28.52 4.47,31.55 4.88,31.95 9.37,31.95 9.75,32.33 9.75,33.98 10.19,34.42 11.96,34.42 12.54,33.84 D6.C
  Top 0.406: J2.2 7.62,59.69 | 7.62,59.69 7.77,59.84 R48.2 R47.2 | D5.A 5.95,26.9 5.08,26.04 2.54,26.04 1.27,24.77 1.27,16.51 2.54,15.24 C13.2 | R8.2 51.44,61.44 51.44,59.69 52.7,58.42 v53.98,58.42 46.84,58.42 R5.2 | R55.1 89.36,7.75 89.99,7.11 89.99,3.3 89.36,2.67 C29.2 84.91,2.67 82.37,5.21 R56.2 78.44,1.42 68.61,1.42 65.66,4.37 65.66,17.65 61.09,22.23 v46.35,22.23 | JP4.2 6.35,59.69 7.62,59.69 | v55.22,30.71 46.02,30.71 45.31,31.42 JP1.1 45.31,33.93 46.33,34.95 59.18,34.95 67.39,26.75 67.39,8.84 67.37,8.83 JP3.4
  Top 0.61: J1.VBUS 12.09,38.76 12.7,39.37 12.7,44.45 8.26,48.9 v8.26,52.07 7.62,52.7 7.62,56.52 8.89,57.78 J2.2
  Top 1.016: IC6.4 IC6.2 42.29,44.76 C38.+ 47.58,41.66 47.7,41.77 | D4.A 51.44,48.6 51.44,47.2 C35.1 49.53,46.35 v48.9,45.72 48.73,45.55 D3.C 47.7,41.77 | v47.12,44.98 47.14,44.96 47.14,41.8 47.17,41.77 47.7,41.77
  Bottom 0.305: v21.59,39.37 22.09,39.88 C23.1 19.05,44.32 19.05,48.26 19.37,48.58 | v27.3,43.81 27.81,43.05 C20.1 | C21.1 29.21,48.9 29.84,49.53 v29.84,50.8 29.84,54.61 30.48,55.24 30.48,59.69 v29.84,60.33 IC2.5 v27.94,63.5 | v16.51,36.83 16.51,38.76 | v18.41,63.5 15.24,63.5 J2.2
  Bottom 0.406: R9.2 61.47,35.31 68.4,28.37 68.4,7.82 68.38,7.82 JP3.4 | R10.2 51.1,44.63 47.47,44.63 v47.12,44.98 | v55.22,30.71 55.35,30.71 55.7,31.06 | C19.1 22.09,47.62 v20.32,47.62 19.37,48.58
  Bottom 0.61: J1.VBUS 16.51,38.76 20.98,38.76 v21.59,39.37 | 19.37,48.58 15.88,52.07 v8.26,52.07 | X2.3 92.33,64.14 75.56,64.14 71.75,67.94 59.69,67.94 59.05,67.31 59.05,63.5 v53.98,58.42 52.07,56.52 48.26,56.52 46.35,54.61 46.35,48.26 v48.9,45.72 | v31.75,24.13 32.21,23.75 46.97,23.75 46.97,22.84 v46.35,22.23 45.09,20.95 JP5.4
  Bottom 0.813: 48.39,23.75 46.97,23.75
  Bottom 1.016: 48.39,23.75 55.7,31.06 55.7,36.4 v47.12,44.98
  pour Top (isolate 0.406, no thermals): 43.81,43.18 43.81,49.53 45.72,51.44 45.72,53.98 38.73,53.98 38.73,48.9 40.64,48.9 41.27,48.26 41.27,43.18
+7V
  Top 0.61: L1.1 59.28,55.75 R6.2
  Top 0.813: L1.1 53.32,54.63 C33.1 53.09,53.09 52.7,52.7 50.16,52.7 48.47,51.01 D4.C
  Top 1.016: IC6.3 44.59,48.91 45.72,50.04 D4.C
+12V
  Top 0.762: U$3.10 80.44,26.09 80.44,38.1 80.44,38.33 | R19.2 69.22,42.7 69.22,38.86 80.44,38.86 80.44,38.33 | 80.44,38.33 97.79,38.33
  Top 0.813: X1.2 97.79,29.84
  Top 1.016: 87.66,55.24 D1.A 73.95,58.12 72.39,59.69 57.78,59.69 57.15,59.05 57.15,57.78 56.52,57.15 45.09,57.15 43.81,58.42 42.7,58.42 R49.2 | 87.66,55.24 88.69,54.19 X2.14 | 87.66,55.24 87.96,55.55 95.76,55.55 97.79,53.52 97.79,38.33 97.79,38.1 97.79,29.84
AUX-1-CPU
  Top 0.305: U$3.7 73.08,28.63 72.03,29.67 72.03,33.1 69.34,35.79 63.93,35.79 63,36.55 33.3,36.55 32.38,35.64 31.67,35.64 31.4,35.91 IC1.50
  Top 0.406: U$3.7 U$3.8
AUX-1-OUT
  Top 0.61: U$3.12 U$3.11 85.67,27.36 86.64,26.39 86.64,24.64 87.76,23.52 92.73,23.52 94.83,25.61 X1.3
AUX-2-CPU
  Top 0.305: IC1.52 33.42,39.56 35.14,39.56 35.56,39.15 35.56,37.67 36.2,37.03 63.45,37.03 64.19,36.3 69.57,36.3 72.62,33.25 72.62,31.7 73.15,31.17 U$3.5
  Top 0.406: U$3.5 U$3.6
AUX-2-OUT
  Top 0.61: U$3.14 U$3.13 85.34,29.9 89.33,25.91 X1.6
AUX-3-CPU
  Top 0.305: IC1.54 33.42,40.56 34.81,40.56 36.22,39.15 36.22,37.77 36.4,37.59 63.63,37.59 64.36,36.85 69.88,36.85 73.1,33.63 74.14,33.63 U$3.3
  Top 0.406: U$3.3 U$3.4
AUX-3-OUT
  Top 0.61: X1.4 88.02,34.05 87.68,33.71 U$3.16 U$3.15
AUX-4-CPU
  Top 0.305: IC1.56 33.42,41.56 34.56,41.56 35.19,41.56 35.97,40.79 35.97,40.16 36.02,40.11 36.75,39.37 36.75,38.15 36.76,38.15 38.48,38.15 60.68,38.15 63.8,38.15 64.49,37.47 72.7,37.47 U$3.1
  Top 0.406: U$3.1 U$3.2
AUX-4-OUT
  Top 0.61: X1.1 94.83,34.08 92.71,36.2 84.07,36.2 U$3.18 U$3.17
AUXT1-CPU
  Top 0.305: IC1.97 20.9,54.66 19.68,55.88 17.8,55.88 17.48,56.21 IC5.1 13.34,59.69
  Top 0.406: C6.1 6.35,67.81 6.35,66.83 R43.2 9.68,63.5 12.06,63.5 12.7,62.87 12.7,60.33 13.34,59.69
AUXT1-IN  (via drill 0.35)
  Top 0.406: R48.1 R43.1 3.81,65.41 2.54,66.67 v2.54,71.12 2.54,71.75 3.81,73.03 C5.1
  Bottom 0.508: X2.1 94.19,75.36 93.34,76.2 86.36,76.2 85.09,74.93 6.35,74.93 v2.54,71.12
AUXT2-CPU
  Top 0.305: IC1.96 21.4,54.81 19.87,56.34 19.86,56.34 19.36,56.84 IC5.3 19.36,60.66 19.05,60.96 16.51,60.96 15.88,61.59 15.88,64.14 14.53,65.48 14.05,65.48
  Top 0.406: C8.1 12.7,67.81 12.7,66.83 14.05,65.48 R44.2
AUXT2-IN  (via drill 0.35)
  Top 0.406: R47.1 14.12,62.56 11.35,65.33 R44.1 9.53,67.16 v9.53,71.12 9.53,72.39 10.16,73.03 C7.1
  Bottom 0.508: X2.2 91.94,67.94 86.36,67.94 83.19,71.12 31.75,71.12 28.57,67.94 22.23,67.94 17.14,73.03 11.43,73.03 v9.53,71.12
BATT-CPU  (via drill 0.35)
  Top 0.305: IC1.95 21.88,53.1 21.88,54.98 20.32,56.54 20.32,60.33 19.81,60.83 19.81,60.84 19.36,61.3 IC5.4 19.36,63.17 v19.68,63.5
  Top 0.406: C2.1 38.1,67.81 v38.1,67.31 38.1,66.83 R41.2
  Bottom 0.305: v38.1,67.31 31.11,67.31 29.21,65.41 22.23,65.41 20.32,63.5 v19.68,63.5
BUTTON1  (via drill 0.35)
  Top 0.254: IC1.60 34.51,43.59 36.83,41.27 36.83,40.55 37.87,39.51 37.87,39.4
  Top 0.406: v64.77,38.73 58.42,38.73 56.52,40.64 50.8,40.64 49.55,39.4 37.87,39.4
  Bottom 0.406: X2.7 92.29,49.2 90.71,47.17 83.04,47.19 82.26,46.38 78.28,46.38 73.81,41.91 66.67,41.91 64.77,40.01 v64.77,38.73 64.77,37.47 R9.1
BUTTON2  (via drill 0.35)
  Top 0.254: IC1.58 33.45,42.54 34.27,42.54 34.84,42.55 36.4,41 36.4,40.39 37.34,39.45 37.34,38.73
  Top 0.406: v54.59,39.78 53.18,38.73 37.34,38.73
  Bottom 0.406: X2.15 88.69,50.12 91.24,52.73 91.24,54.15 92.61,55.52 95.25,55.52 96.32,56.59 96.32,58.87 95.39,59.55 93.89,59.55 93.42,59.54 92.03,60 82.29,60 81.66,59.54 81.28,59.23 81.28,48.59 80.95,48.23 77.37,48.23 74.3,45.09 73.03,43.81 57.3,43.81 R10.1 55.88,42.39 55.88,40.64 55.02,39.78 54.51,39.78 v54.59,39.78
FUEL-CPU  (via drill 0.35)
  Top 0.305: IC1.93 22.9,57.19 25.4,59.69 25.4,60.63 IC2.6 27,63.17 v26.67,63.5
  Top 0.406: C25.1 45.09,67.81 v45.09,67.31 45.09,66.83 R2.2
  Bottom 0.305: v45.09,67.31 40.01,67.31 38.73,66.04 30.49,66.04 29.4,64.95 29.39,64.95 29.21,64.77 27.3,64.77 26.67,64.14 v26.67,63.5
FUEL-IN
  Top 0.406: C24.1 41.91,71.25 41.91,66.67 43.18,65.41 R2.1 45.09,63.98 45.09,63.02 R5.1 48.26,61.59 48.9,62.23 48.9,62.87 49.53,63.5 52.07,63.5 52.7,62.87 52.7,60.33 53.34,59.69 55.88,59.69 56.52,60.33 56.52,61.59 58.42,63.5 73.5,63.5 73.78,63.22 83.94,63.22 87.47,59.69 92.09,59.69 X2.4
GND  (via drill 0.35)
  Top 0.305: C17.2 C18.2 10.62,30.79 v10.62,33.02 | C22.2 v13.97,15.24 C13.1 | C15.2 v27.94,27.3 C14.2 | U$2.1 18.57,23.5 v19.68,23.5 | IC1.11 18.68,46.09 18.73,46.04 19.37,46.04 20.09,45.32 20.09,45.31 v20.32,45.09 | v28.57,50.8 28.9,51.12 IC1.81 28.9,54.3 29.84,55.24 34.29,55.24 | v23.5,39.37 22.4,38.27 IC1.32 22.4,29.39 21.84,28.83 21.84,25.91 22.23,25.4 27.3,25.4 | v26.67,46.35 28.44,44.59 IC1.62 39.86,44.59 39.99,44.45 | 34.29,55.24 38.1,55.24 39.37,56.52 | 39.37,56.52 39.52,56.67 R50.1 | 69.56,51.09 D2.A | JP2.3 35.56,51.44 v34.29,52.7 34.29,55.24 | v18.41,57.78 IC5.2 | IC2.2 v27.94,57.78 | 43.18,56.52 39.37,56.52 | C32.2 87.45,5.21 86.82,5.84 v86.82,6.48 | JP4.1 2.54,65.41 1.27,66.67 1.27,71.75 3.81,74.3 5.08,74.3 5.08,75.56 5.71,76.2 v8.26,76.2
  Top 0.406: v8.26,76.2 7.75,75.69 C5.2 C6.2 | v14.61,76.2 14.1,75.69 C7.2 C8.2 | v20.95,76.2 20.45,75.69 C3.2 C4.2 | v27.3,76.2 26.8,75.69 C9.2 C10.2 | v33.66,76.2 33.15,75.69 C11.2 C12.2 | v40.01,76.2 39.5,75.69 C1.2 C2.2 | 43.18,56.52 44.83,54.86 48.26,54.86 | 48.26,54.86 C33.2 | R20.2 8.38,30.48 C17.2 | v56.52,48.26 54.61,46.35 C35.2 | v67.94,48.26 67.94,49.53 | v48.26,53.98 48.26,54.86 | C25.2 C24.2 46.35,73.16 v46.35,76.2 | C27.2 C26.2 53.98,73.16 v53.98,76.2 | v97.16,72.39 92.71,72.39 92.08,73.03 92.08,76.2 92.71,76.83 v94.61,76.83 | JP5.3 38.73,24.13 34.29,24.13 v33.66,24.77 33.02,25.4 27.3,25.4 27.94,26.04 v27.94,27.3
  Top 0.508: U$1.1 66.99,49.85 67.31,49.53 67.94,49.53 69.2,50.78 69.2,51.09 | C31.2 71.73,44.25 85.09,44.25 86.36,45.52 86.36,50.16 87.63,51.44 90.81,51.44 92.76,53.39 X2.6
  Top 0.61: 69.2,51.09 69.56,51.09 | R3.2 66.32,53.98 67.31,53.98 v67.94,53.34 67.94,52.7 69.22,51.44 D2.A 69.85,50.8 70.36,50.3 C30.2 70.36,45.72 C31.2 | C28.2 89.23,15.37 | 89.23,15.37 OK1.2 | 89.23,15.37 84.96,15.37 82.55,17.78 OK1.4 78.54,17.78 78,18.31 78,25.93 v77.88,26.06 | v77.88,26.06 74.24,26.06 U$3.9 | v77.55,29.87 77.55,26.39 v77.88,26.06
  Top 0.813: C35.2 53.39,43.07 D3.A
  Top 1.016: IC6.1 39.99,44.45 39.99,41.92 40.01,41.91 39.75,41.66 C38.-
  Bottom 0.305: v13.97,15.24 13.97,17.78 v19.68,23.5 | v19.68,23.5 23.5,27.3 v27.94,27.3 29.57,25.68 48.72,25.68 52.93,29.9 JP1.4 | J1.GND 9.08,34.56 v10.62,33.02 19.68,23.95 v19.68,23.5 | v20.32,45.09 20.45,44.95 C19.2 23.5,44.95 | 23.5,44.95 23.62,44.95 24.77,43.81 24.77,41.41 C23.2 24.89,40.13 24.13,39.37 v23.5,39.37 | C20.2 27.18,45.85 v26.67,46.35 26.04,46.99 | 26.04,46.99 25.91,47.12 C21.2 25.91,50.03 26.67,50.8 v28.57,50.8 28.57,54.61 27.94,55.24 | 23.5,44.95 25.53,46.99 26.04,46.99 | J2.6 v18.41,57.78 24.77,57.78 v27.3,55.24 27.94,55.24 | v27.94,57.78 27.94,55.24
  Bottom 0.406: v8.26,76.2 v14.61,76.2 v20.95,76.2 v27.3,76.2 v33.66,76.2 v40.01,76.2 v46.35,76.2 v53.98,76.2 74.93,76.2 75.56,76.83 v94.61,76.83 | v67.94,48.26 v56.52,48.26 52.07,48.26 48.26,52.07 v48.26,53.98 | X2.6 95.3,53.39 97.16,55.24 | 97.16,55.24 v97.16,59.05 v97.16,72.39 | 97.16,55.24 97.79,54.61 97.79,33.02 97.16,32.38 91.86,32.38 X1.5 | v86.82,6.48 86.82,23.52 84.28,26.06 v77.88,26.06
  Bottom 0.61: v77.88,26.06 77.88,24.97 72.59,19.68 72.59,6.15 JP3.3
  Bottom 1.016: 75.77,29.87 v77.55,29.87 89.3,29.87 X1.5
  other vias: 6.35,13.97 61.59,66.04 69.85,66.04 56.52,52.7 41.91,55.24 62.87,40.64 86,42.19 84.45,13.97 84.45,17.14 97.16,17.14 92.08,27.3 70.05,29.87 8.76,32.87 38.1,19.05 43.18,19.05 56.52,20.95 52.7,20.95 28.57,40.01 23.5,50.8 30.48,48.26 27.94,29.21 23.5,29.21 7.62,40.01 3.17,40.01 66.04,61.59 12.7,20.95 12.95,37.36
  pour Top (isolate 0.254, rank 2): -1.27,80.64 -1.27,-1.27 101.6,-1.27 101.6,80.64
  pour Bottom (isolate 0.254): -1.27,80.01 -1.27,-1.27 101.6,-1.27 101.6,80.64 -0.64,80.64
MAP-CPU
  Top 0.305: IC2.3 28.88,58.42 | 28.88,58.42 29.84,58.42 32.38,60.96 32.38,63.5 33.17,64.29 R46.2 | IC1.90 24.4,54.88 26.04,56.52 27.94,56.52 28.88,57.45 28.88,58.42
  Top 0.406: C12.1 31.75,67.81 31.75,66.83 R46.2
MAP-IN  (via drill 0.35)
  Top 0.406: R46.1 30.33,65.56 28.57,67.31 v28.57,71.12 28.57,71.25 C11.1
  Bottom 0.508: v28.57,71.12 29.84,72.39 86.49,72.39 X2.10
MISO-CPU
  Top 0.305: IC1.22 15.93,40.59 13.34,43.18 13.34,45.09 9.8,48.62 9.78,48.62 9.25,49.15 9.25,53.08 9.53,53.36 J2.1
MOSI-CPU
  Top 0.305: IC1.21 17.38,41.1 16.06,41.1 13.97,43.19 13.97,45.09 13.79,45.26 13.79,45.27 9.99,49.07 9.97,49.07 9.7,49.34 9.7,52.89 10.79,53.99 10.79,56.52 J2.4
  Bottom 0.254: J2.4 10.79,56.52 8.89,56.52 8.26,57.15 8.26,59.69 7.62,60.33
  Bottom 0.406: JP4.5 1.27,54.61 1.27,59.69 1.91,60.33 7.62,60.33
N$2
  Top 0.305: U$2.5 13.34,24.77 14.76,26.19 14.76,34.4 12.51,36.65 7.62,36.65 6.35,37.92 6.35,40.64 6.96,41.26 J1.D+
N$3
  Top 0.305: U$2.6 12.06,24.77 14.28,26.98 14.28,34.04 12.12,36.2 6.99,36.2 5.71,37.47 5.71,41.27 7.62,43.18 10.79,43.18 11.06,42.91 J1.D-
N$5
  Top 0.305: IC1.34 23.4,34.38 24.13,33.66 29.21,33.66 30.48,32.38 | 30.48,32.38 Y2.2 | C14.1 32.52,28.45 30.48,30.48 30.48,32.38
N$6
  Top 0.305: IC1.33 22.9,33.62 24.13,32.38 25.4,32.38 | 25.4,32.38 Y2.1 | C15.1 23.36,27.81 25.4,29.84 25.4,32.38
N$8
  Top 0.406: R20.1 3.02,28.02 D5.C
N$9
  Top 0.305: C16.2 17.78,26.04 18.41,25.4 19.68,25.4 21.59,23.5 24.21,23.5 24.77,22.94 24.77,17.14 24.13,16.51 21.59,16.51 20.32,17.78 19.05,20.32 15.24,20.32 14.61,19.68 U$2.13
N$13  (via drill 0.35)
  other vias: 16.51,53.98
N$15
  Top 0.305: Y1.1 6.48,18.54 8.89,20.95 9.53,20.95 10.79,22.23 U$2.7 10.79,24.77 11.43,25.4 C18.1
N$16
  Top 0.305: C17.1 8.89,25.4 9.53,24.77 U$2.8 9.53,22.23 8.89,22.23 7.75,23.37 Y1.2
N$22
  Top 0.61: 73.36,51.44 D1.C 69.56,55.54 69.22,55.88 65.41,55.88 64.77,55.24 64.77,52.07 65.09,51.75 U$1.3 | 73.36,51.44 D2.C | 73.36,51.44 73.36,48.47 C30.1 73.1,48.21 C31.1
N$23
  Top 0.61: U$1.6 63.47,47.59 62.87,46.99 61.59,46.99 60.45,45.85 C34.2
N$24
  Top 0.61: U$1.5 64.77,50.8 64.77,46.99 63.98,46.2 R19.1
N$42
  Top 0.406: C1.1 34.92,71.25 34.92,67.16 R41.1 R49.1 R50.2
N$100
  Top 0.305: R1.1 D19.C
N$101
  Top 0.305: R51.1 D18.C
N$107
  Top 0.406: R54.1 88.39,21.95 80.92,21.95 79.36,23.51 79.37,36.74 78.08,38.05 67.88,38.05 66.91,39.01 D20.C
N$108
  Top 0.406: R54.2 94.77,15.39 94.54,15.16 94.54,14.4 C28.1
  Top 0.61: C28.1 89.23,12.57 OK1.1
N$110
  Top 0.406: R56.1 85.06,7.67 D21.A
NEO-OUT  (via drill 0.35)
  Top 0.305: X2.16 86.88,43.18 69.85,43.18 67.94,45.09 67.94,46.35 67.31,46.99 65.96,46.99 64.77,45.8 64.77,43.18 64.14,42.55 55.7,42.55 54.45,41.29 50.47,41.29 49.66,40.49 45.92,40.49 v45.57,40.13 | IC1.72 31.17,49.59 31.11,49.53 31.75,48.9 31.75,47.62 v31.11,46.99
  Bottom 0.305: v45.57,40.13 31.9,40.13 31.62,40.41 31.62,46.33 31.11,46.84 v31.11,46.99
O2-CPU
  Top 0.254: 17.78,64.14 18.12,64.14 18.14,64.16 18.69,64.16 18.71,64.14 19.2,64.14 R42.2
  Top 0.305: 17.78,64.14 17.48,63.83 IC5.6 | IC1.94 22.4,55.1 20.95,56.55 20.95,64.92 R42.2
  Top 0.406: C4.1 19.05,67.81 19.05,66.83 R42.2
O2-IN  (via drill 0.35)
  Top 0.406: R42.1 15.88,67.16 v15.88,71.12 15.88,71.25 C3.1
  Bottom 0.508: v15.88,71.12 20.64,66.36 28.89,66.36 32.38,69.85 71.75,69.85 75.61,65.99 X2.11
OILP-CPU  (via drill 0.35)
  Top 0.305: R45.2 26.67,65.41 v25.4,64.14 | IC1.91 23.9,55.65 v26.67,58.42 27,58.75 IC2.1
  Top 0.406: C10.1 25.4,67.81 25.4,66.83 R45.2
  Bottom 0.305: v25.4,64.14 25.4,59.69 v26.67,58.42
OILP-IN  (via drill 0.35)
  Top 0.406: R45.1 22.23,67.16 v22.23,71.12 22.23,71.25 C9.1
  Bottom 0.508: v22.23,71.12 25.5,73.75 88.06,73.75 X2.9
OILT-CPU  (via drill 0.35)
  Top 0.305: IC1.92 23.4,56.42 26.04,59.05 26.04,60.33 26.67,60.96 28.57,60.96 28.88,61.27 IC2.4 28.88,62.53 v29.84,63.5
  Top 0.406: C27.1 52.7,67.81 v52.7,67.31 52.7,66.83 R7.2
  Bottom 0.305: v52.7,67.31 51.44,66.04 40.01,66.04 38.73,64.77 31.11,64.77 v29.84,63.5
OILT-IN
  Top 0.406: C26.1 49.53,71.25 49.53,67.16 R7.1 52.7,63.98 53.49,63.98 54.13,63.35 R8.1 55.24,61.59 57.78,64.14 83.82,64.14 86.17,61.79 X2.12
RESET-CPU
  Top 0.254: D6.A 17.78,32.7 C16.1
  Top 0.305: C16.1 20.3,29.98 R4.2 20.32,32.38 21.4,33.47 IC1.30 21.4,38.29 20.32,39.37 20.32,40.01 24.13,43.81 24.13,46.99 20.32,50.8 19.68,50.8 18.41,52.07 14.61,52.07 J2.5
RPM
  Top 0.305: IC1.43 27.9,36.22 29.96,34.16 42.82,34.16 43.66,33.33 43.66,31.59 45.52,29.66 63.11,29.65 66.52,26.49 66.52,4.7 68.99,2.23 77.72,2.23 80.24,4.75 80.24,6.86 81.13,7.75 D21.C
  Top 0.406: R55.2 91.41,8.23 | 82.14,8.15 D21.C
  Top 0.61: R55.2 91.39,7.72 C32.1 C29.1 | 91.41,8.23 89.99,9.65 83.64,9.65 | 83.64,9.65 82.14,8.15 | OK1.5 81.43,15.24 83.64,13.03 83.64,9.65
RPM-IN
  Top 0.762: X2.8 94.19,43.39 91.42,40.62 71.31,40.62 D20.A
RX1
  Top 0.305: IC1.45 28.9,35.87 30.12,34.65 32.89,34.65 33.83,35.59 59.72,35.59 68.17,27.12 68.17,9.2 69.12,8.3 74.09,8.3 75.29,7.05 JP3.2
RX2  (via drill 0.35)
  Top 0.305: IC1.12 18.55,45.59 19.68,44.45 19.68,38.73 18.11,37.16 18.11,35.68 18.41,35.38 v19.2,35.38
  Bottom 0.305: v19.2,35.38 20.02,36.2 37.19,36.2 49.07,36.2 50.34,34.92 50.34,32.77 JP1.3
RX3
  Top 0.305: IC1.63 38.1,45.09 38.73,45.72 38.73,47.62 37.47,48.9 JP2.2
RX-CPU  (via drill 0.35)
  Top 0.305: R51.2 v20.95,22.23 17.78,22.23 17.14,22.86 U$2.2 17.14,24.77 15.75,26.16 15.75,35.71 15.75,39.5 v15.24,40.01 | IC1.2 14.82,50.59 v14.61,50.8
  Bottom 0.305: v15.24,40.01 15.88,40.64 15.88,50.16 15.24,50.8 v14.61,50.8
  Bottom 0.406: v20.95,22.23 34.29,22.23 35.05,22.91 38.05,22.91 39.37,21.59 JP5.2 39.37,19.68 41.27,17.78 44.17,17.78 56.87,30.48 56.87,40.36 59.69,43.18 73.21,43.18 77.65,47.62 81.44,47.62 81.92,48.1 81.92,58.58 82.85,59.31 90.72,59.31 92.44,57.59 X2.5
SCK-CPU
  Top 0.305: IC1.20 16.22,41.59 14.61,43.2 14.61,45.09 14.43,45.26 14.43,45.29 10.18,49.53 10.16,49.53 10.16,52.7 12.06,54.61 J2.3
  Bottom 0.254: 7.62,56.52 7.62,54.61 8.89,53.34 11.43,53.34 12.06,53.98 J2.3
  Bottom 0.406: JP4.3 3.81,57.15 6.99,57.15 7.62,56.52
SW  (via drill 0.35)
  Top 0.61: U$1.2 v67.31,50.8 | L1.2 v58.42,50.16
  Top 0.813: C34.1 58.42,45.85 L1.2
  Bottom 0.61: v58.42,50.16 59.05,50.8 v67.31,50.8
TX1
  Top 0.305: IC1.46 29.4,36.02 30.24,35.18 32.64,35.18 33.53,36.07 38.3,36.07 60.3,36.07 68.73,27.64 68.73,16.59 68.73,9.68 69.52,8.89 76.4,8.89 77.8,7.49 77.83,7.49 JP3.1
TX2  (via drill 0.35)
  Top 0.305: IC1.13 18.4,45.09 19.05,44.44 19.05,38.75 17.6,37.3 17.6,35.49 18.34,34.75 v18.34,34.62
  Bottom 0.305: v18.34,34.62 19.99,34.62 20.9,35.53 46.91,35.53 47.85,34.59 JP1.2
TX3
  Top 0.305: IC1.64 35.42,45.59 JP2.1
TX-CPU  (via drill 0.35)
  Top 0.305: R1.2 20.95,18.41 v20.32,19.68 19.68,20.95 16.51,20.95 15.88,21.59 U$2.3 15.88,24.77 15.21,25.43 15.21,38.76 v13.97,40.01 | IC1.3 15.16,50.09 v14.61,49.53
  Bottom 0.305: v13.97,40.01 13.97,40.64 14.61,41.27 v14.61,49.53
  Bottom 0.406: v20.32,19.68 35.56,19.68 JP5.1 36.83,18.41 38.1,17.14 44.6,17.14 57.58,30.12 57.58,39.8 60.33,42.55 73.46,42.55 77.91,46.99 81.87,46.99 82.56,47.68 82.56,56.21 84.02,57.66 X2.13
VFB
  Top 0.61: U$1.4 63.19,51.75 62.87,52.07 62.87,54.61 R3.1
  Top 0.813: R3.1 63.35,55.93 R6.1

### Text on the board
_tsilk: Dash Control | Version 1.0 | 5V | GND | Serial 3 | 5V | GND | RX | TX | GPS ONLY | Serial 2 | 5V | TX | RX | GND | GPS ONLY | Serial 0 | TX | RX | GND | 5V | Nick Hay 2018 | z_nick_hay_z@hotmail.com | ↑ | Bluetooth | Serial 1 | 5V | GND | RX | TX